# EAGLE design SkateRemote (EAGLE 8.2.0)
COMPANY: ADAFRUIT INDUSTRIES; DRAWN: KTOWN; REV: B
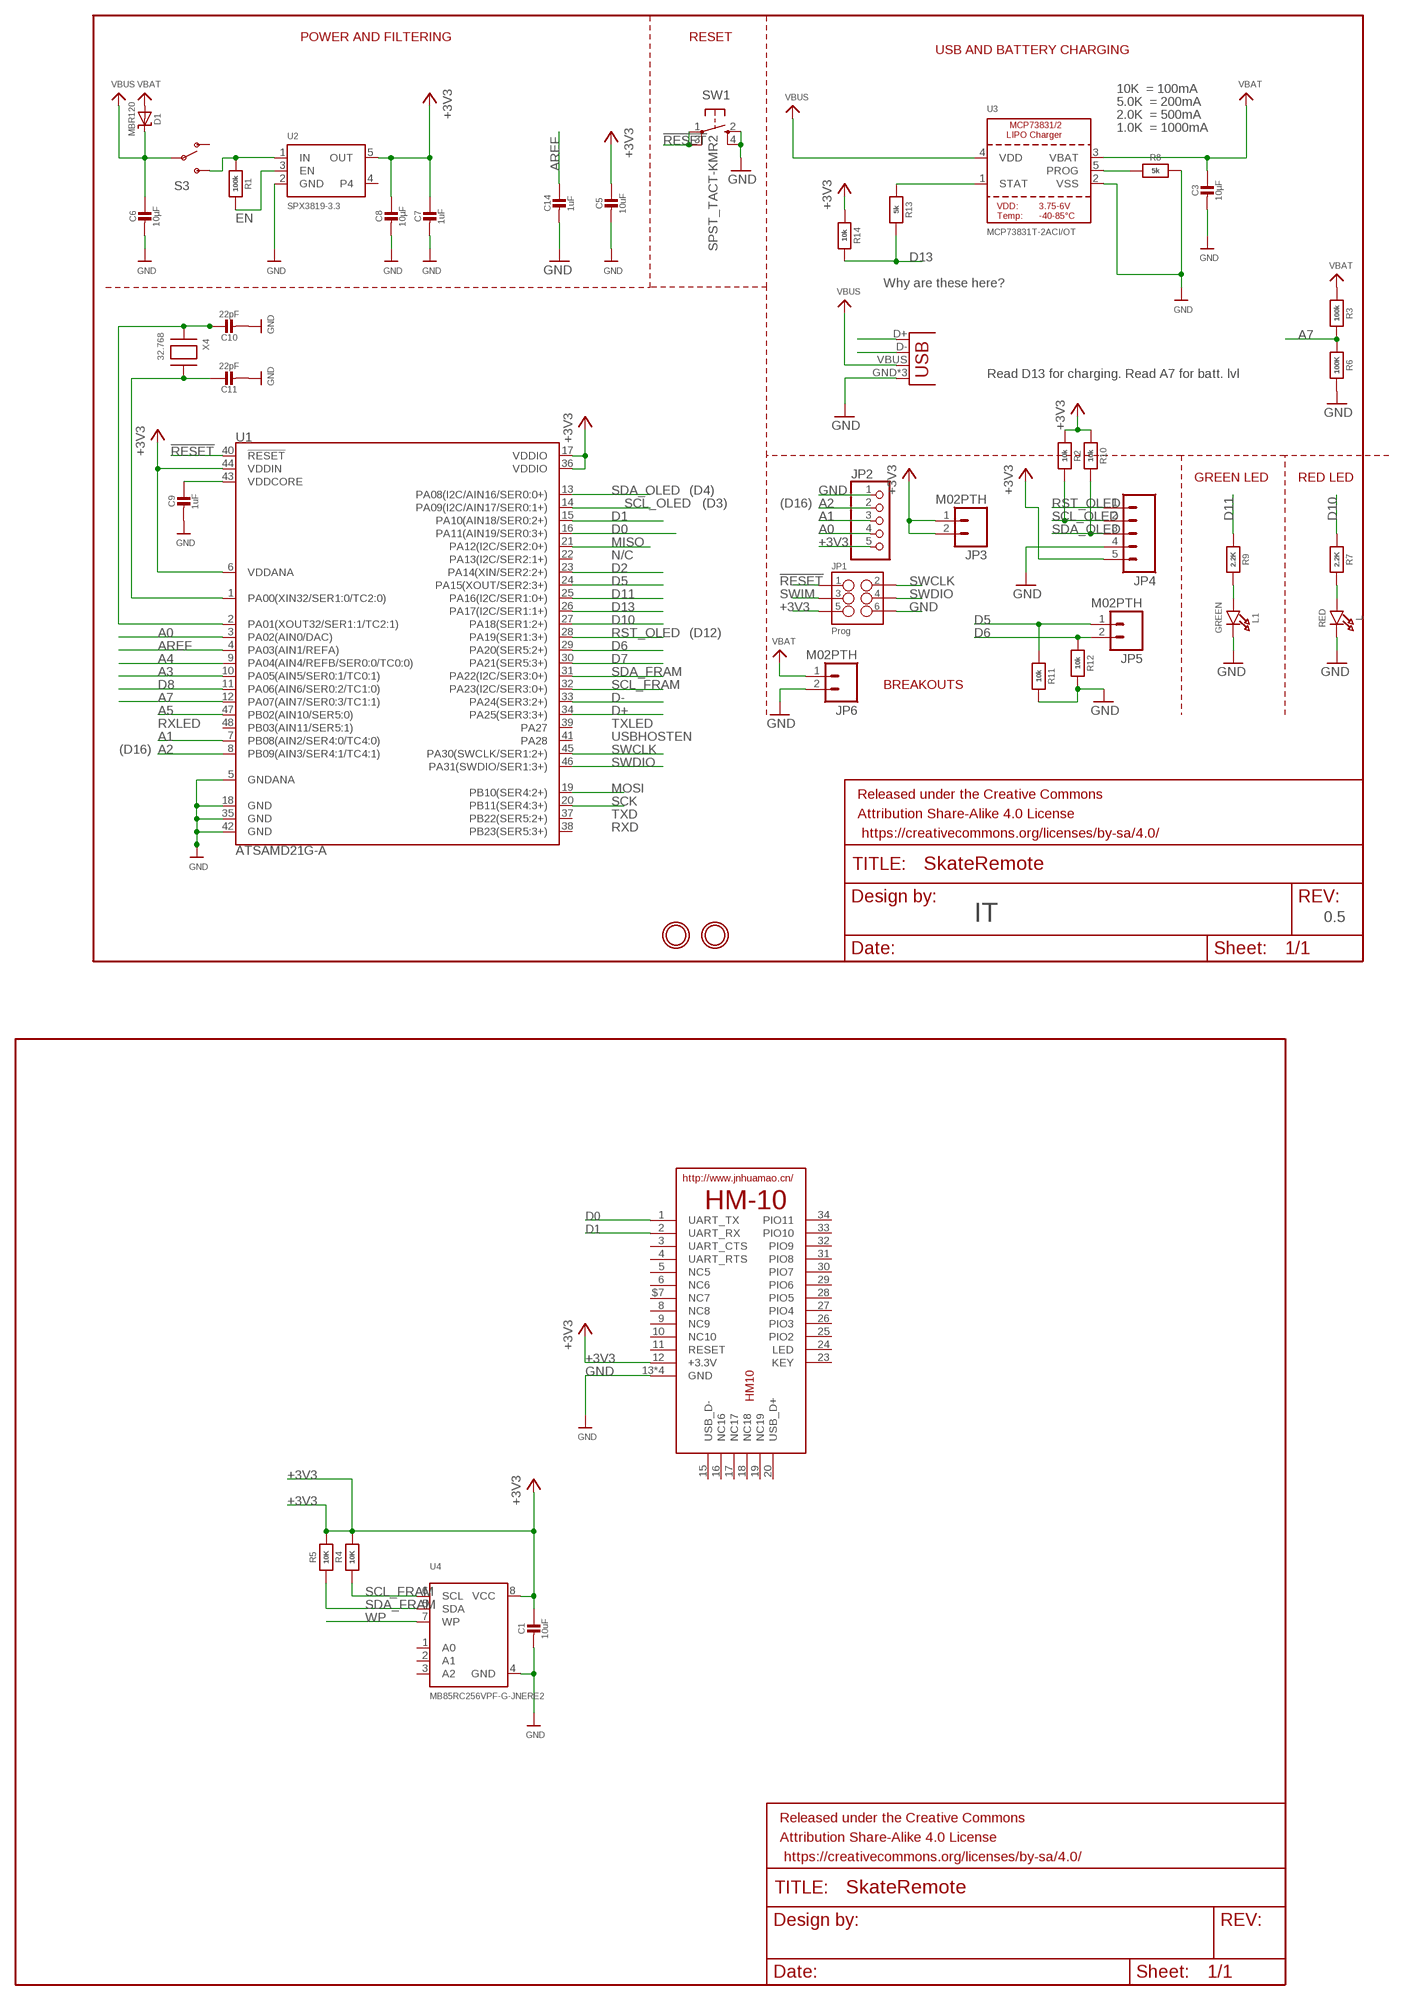
[diagram p0: schematic, sheet 1]

## Parts
C1  10uF  CAP_CERAMIC_0805MP  [_0805MP]
C3  10µF  CAP_CERAMIC0805-NOOUTLINE  [0805-NO]
C5  10uF  CAP_CERAMIC0805-NOOUTLINE  [0805-NO]
C6  10µF  CAP_CERAMIC0805-NOOUTLINE  [0805-NO]
C7  1uF  CAP_CERAMIC0805-NOOUTLINE  [0805-NO]
C8  10µF  CAP_CERAMIC0805-NOOUTLINE  [0805-NO]
C9  1uF  CAP_CERAMIC0805-NOOUTLINE  [0805-NO]
C10  22pF  CAP_CERAMIC0805-NOOUTLINE  [0805-NO]
C11  22pF  CAP_CERAMIC0805-NOOUTLINE  [0805-NO]
C14  1uF  CAP_CERAMIC0805-NOOUTLINE  [0805-NO]
D1  MBR120  DIODE-SCHOTTKYSOD-123  [SOD-123]
FRAME2  FRAME-LETTER  [CREATIVE_COMMONS]
FRAME3  FRAME-LETTER  [CREATIVE_COMMONS]
HM10  HM-10-BOARD  [26.9X13X2.2_BOARD]
JP1  Prog  M03X22X3_SILK_MALE_PTH  [2X3]
JP2  PINHD-1X5  [1X05]
JP3  M02PTH  [1X02]
JP4  M05PTH  [1X05]
JP5  M02PTH  [1X02]
JP6  M02PTH  [1X02]
L  RED  LED0805_NOOUTLINE  [CHIPLED_0805_NOOUTLINE]
L1  GREEN  LED0805_NOOUTLINE  [CHIPLED_0805_NOOUTLINE]
R1  100k  RESISTOR0805_NOOUTLINE  [0805-NO]
R2  10k  RESISTOR0805_NOOUTLINE  [0805-NO]
R3  100k  RESISTOR0805_NOOUTLINE  [0805-NO]
R4  10K  RESISTOR_0805MP  [_0805MP]
R5  10K  RESISTOR_0805MP  [_0805MP]
R6  100K  RESISTOR0805_NOOUTLINE  [0805-NO]
R7  2.2K  RESISTOR0805_NOOUTLINE  [0805-NO]
R8  5k  RESISTOR0805_NOOUTLINE  [0805-NO]
R9  2.2K  RESISTOR0805_NOOUTLINE  [0805-NO]
R10  10k  RESISTOR0805_NOOUTLINE  [0805-NO]
R11  10k  RESISTOR0805_NOOUTLINE  [0805-NO]
R12  10k  RESISTOR0805_NOOUTLINE  [0805-NO]
R13  5k  RESISTOR0805_NOOUTLINE  [0805-NO]
R14  10k  RESISTOR0805_NOOUTLINE  [0805-NO]
S3  SWITCH-SPDT-SMD-A  [SWITCH-SPST-SMD-A]
SW1  SPST_TACT-KMR2  [KMR2]
U1  ATSAMD21G-A  [TQFP-48]
U2  SPX3819-3.3  VREG_SOT23-5  [SOT23-5]
U3  MCP73831T-2ACI/OT  MCP73831/2  [SOT23-5]
U4  MB85RC256VPF-G-JNERE2  FRAM_SOIC8_I2C  [SOIC8_208MIL]
U$31  MOUNTINGHOLE2.5  [MOUNTINGHOLE_2.5_PLATED]
U$32  MOUNTINGHOLE2.5  [MOUNTINGHOLE_2.5_PLATED]
X3  microUSB  USB-MICROB  [USB-MICROB]
X4  32.768  XTAL-3.2X1.5  [XTAL3215]

## Nets
!RESET: JP1.1 SW1.1(P) SW1.3(P1) U1.40(!RESET!)
+3V3: C1.1 C5.1 C7.1 C8.1 HM10.12(+3.3V) JP1.5 JP2.5 JP3.1 JP3.2 JP4.5 R2.1 R4.2 R5.2 R10.1 R14.1 U1.6(VDDANA) U1.17(VDDIO) U1.36(VDDIO) U1.44(VDDIN) U2.5(OUT) U4.8(VCC)
A0: JP2.4 U1.3(PA02(AIN0/DAC))
A1: JP2.3 U1.7(PB08(AIN2/SER4:0/TC4:0))
A2: JP2.2 U1.8(PB09(AIN3/SER4:1/TC4:1))
A3: U1.10(PA05(AIN5/SER0:1/TC0:1))
A4: U1.9(PA04(AIN4/REFB/SER0:0/TC0:0))
A5: U1.47(PB02(AIN10/SER5:0))
A7: R3.2 R6.1 U1.12(PA07(AIN7/SER0:3/TC1:1))
AREF: C14.1 U1.4(PA03(AIN1/REFA))
D0: HM10.1(UART_TX) U1.16(PA11(AIN19/SER0:3+))
D1: HM10.2(UART_RX) U1.15(PA10(AIN18/SER0:2+))
D2: U1.23(PA14(XIN/SER2:2+))
D5: JP5.1 R11.1 U1.24(PA15(XOUT/SER2:3+))
D6: JP5.2 R12.1 U1.29(PA20(SER5:2+))
D7: U1.30(PA21(SER5:3+))
D8: U1.11(PA06(AIN6/SER0:2/TC1:0))
D10: R7.1 U1.27(PA18(SER1:2+))
D11: R9.1 U1.25(PA16(I2C/SER1:0+))
D13: R13.2 R14.2 U1.26(PA17(I2C/SER1:1+))
D+: U1.34(PA25(SER3:3+)) X3.D+
D-: U1.33(PA24(SER3:2+)) X3.D-
EN: R1.2 U2.3(EN)
GND: C1.2 C3.2 C5.2 C6.2 C7.2 C8.2 C9.2 C10.2 C11.2 C14.2 HM10.13(GND) HM10.14(GND) HM10.21(GND) HM10.22(GND) JP1.6 JP2.1 JP4.4 JP6.2 L1.C L.C R6.2 R8.2 R11.2 R12.2 SW1.2(S) SW1.4(S1) U1.5(GNDANA) U1.18(GND) U1.35(GND) U1.42(GND) U2.2(GND) U3.2(VSS) U4.4(GND) X3.GND X3.MT1(GND) X3.MT2(GND)
MISO: U1.21(PA12(I2C/SER2:0+))
MOSI: U1.19(PB10(SER4:2+))
N$1: R13.1 U3.1(STAT)
N$2: L.A R7.2
N$4: R8.1 U3.5(PROG)
N$5: R1.1 S3.3(S) U2.1(IN)
N$6: L1.A R9.2
N$23: C10.1 U1.2(PA01(XOUT32/SER1:1/TC2:1)) X4.P$1
N$29: C11.1 U1.1(PA00(XIN32/SER1:0/TC2:0)) X4.P$2
RST_OLED: JP4.1 U1.28(PA19(SER1:3+))
SCK: U1.20(PB11(SER4:3+))
SCL_FRAM: R4.1 U1.32(PA23(I2C/SER3:0+)) U4.6(SCL)
SCL_OLED: JP4.2 R2.2 U1.14(PA09(I2C/AIN17/SER0:1+))
SDA_FRAM: R5.1 U1.31(PA22(I2C/SER3:0+)) U4.5(SDA)
SDA_OLED: JP4.3 R10.2 U1.13(PA08(I2C/AIN16/SER0:0+))
SWCLK: JP1.2 U1.45(PA30(SWCLK/SER1:2+))
SWDIO: JP1.4 U1.46(PA31(SWDIO/SER1:3+))
SWIM: JP1.3
VBAT: C3.1 D1.A JP6.1 R3.1 U3.3(VBAT)
VBUS: C6.1 D1.C S3.2(P) U3.4(VDD) X3.VBUS
VDDCORE: C9.1 U1.43(VDDCORE)
WP: U4.7(WP)
Unconnected: HM10.3(UART_CTS) HM10.4(UART_RTS) HM10.5(NC5) HM10.6(NC6) HM10.8(NC8) HM10.9(NC9) HM10.10(NC10) HM10.11(RESET) HM10.15(USB_D-) HM10.16(NC16) HM10.17(NC17) HM10.18(NC18) HM10.19(NC19) HM10.20(USB_D+) HM10.23(KEY) HM10.24(LED) HM10.25(PIO2) HM10.26(PIO3) HM10.27(PIO4) HM10.28(PIO5) HM10.29(PIO6) HM10.30(PIO7) HM10.31(PIO8) HM10.32(PIO9) HM10.33(PIO10) HM10.34(PIO11) HM10.$7(NC7) S3.1(O) U1.22(PA13(I2C/SER2:1+)) U1.37(PB22(SER5:2+)) U1.38(PB23(SER5:3+)) U1.39(PA27) U1.41(PA28) U1.48(PB03(AIN11/SER5:1)) U2.4 U4.1(A0) U4.2(A1) U4.3(A2)

## Notes on the sheet
- POWER AND FILTERING | RESET
- USB AND BATTERY CHARGING
- 10K  = 100mA
- 5.0K  = 200mA
- 2.0K  = 500mA
- 1.0K  = 1000mA
- Why are these here?
- Read D13 for charging. Read A7 for batt. lvl
- GREEN LED | RED LED
- (D4)
- (D3) | (D16)
- N/C
- (D12)
- BREAKOUTS
- RXLED | TXLED
- USBHOSTEN
- (D16)
- TXD
- RXD
- IT | 0.5

## Library data of the parts
C1 C3 C5-C11 C14 = microbuilder:CAP_CERAMIC: Ceramic Capacitors For new designs, use the packages preceded by an '_' character since they are more reliable: The following footprints should be used on most boards: _0402 - Standard footprint for regular board layouts _0603 - Standard footprint for regular board layouts _0805 - Standard footprint for regular board layouts _1206 - Standard footprint for regular board layouts For extremely tight-pitch boards where space is at a premium, the following 'micro-pitch' footprints can be used (smaller pads, no silkscreen outline, etc.): _0402MP - Micro-pitch footprint for very dense/compact boards _0603MP - Micro-pitch footprint for very dense/compact boards _0805MP - Micro-pitch footprint for very dense/compact boards _1206MP - Micro-pitch footprint for very dense/compact boards
D1 = microbuilder:DIODE-SCHOTTKY
FRAME2 FRAME3 = SparkFun-Aesthetics:FRAME-LETTER: Schematic Frame Standard 8.5x11 US Letter frame
HM10 = JNHuaMao-NoLabels:HM-10: HM Bluetooth module use TI CC2540 or CC2541, Master and slave roles in one, transmission version and remote control version and PIO state acquisition functions in one, Support the AT command modify module parameters, Convenient and flexible.
JP1 = SparkFun-Connectors:M03X2: 2x3 .1" header. Shrouded, with keying- CONN-10681 SMT- CONN-11415 Pogo pins- HW-11044; PROD_ID: CONN-09701
JP2 = pinhead:PINHD-1X5: PIN HEADER
JP3 JP5 JP6 = SparkFun-Connectors:M02: Standard 2-pin 0.1" header. Use with - straight break away headers ( PRT-00116) - right angle break away headers (PRT-00553) - swiss pins (PRT-00743) - machine pins (PRT-00117) - female headers (PRT-00115) Molex polarized connector foot print use with: PRT-08233 with associated crimp pins and housings. 2.54_SCREWTERM for use with PRT-10571. 3.5mm Screw Terminal footprints for PRT-08084 5mm Screw Terminal footprints for use with PRT-08432
JP4 = SparkFun-Connectors:M05: Header 5 Standard 5-pin 0.1" header. Use with straight break away headers (SKU : PRT-00116), right angle break away headers (PRT-00553), swiss pins (PRT-00743), machine pins (PRT-00117), and female headers (PRT-00115). Molex polarized connector foot print use with SKU : PRT-08230 with associated crimp pins and housings.
L L1 = microbuilder:LED: LED 0603 - 0603 Surface Mount Package 2mA: Green LED - Low Power (3.9mcd, 2ma, 1.7Vf) - Digikey: 475-2709-2-ND Orange LED - Low Power (9.8mcd, 2ma, 1.8Vf) - Digikey: 475-1194-2-ND Red LED - Low Power (5mcd, 2ma, 1.8Vf) - Digikey: 475-1195-2-ND Yellow LED - Low Power (7mcd, 2ma, 1.8Vf) - Digikey: 475-1196-2-ND 5mA: Blue LED - Low Power (17mcd, 5ma, 2.9Vf) - Digikey: LNJ937W8CRACT-ND 0805 - 0805 Surface Mount Package 2mA: Red LED (8.8mcd, 2mA, 1.8Vf, Clear) - Low Power [Digikey: 475-2510-1-ND] Green LED (5mcd, 2mA, 1.8Vf, Clear) - Low Power [Digikey: 475-2730-1-ND] Yellow LED (11.3mcd, 2mA, 1.8Vf, Clear) - Low Power [Digikey: 475-2555-1-ND] 20mA: Red LED (104mcd, 20mA, Diffused) - LS R976 [Digikey: 475-1278-6-ND] Red LED (12mcd, 20mA, 2.0Vf, Clear) - APT2012EC [Digikey: 754-1128-1-ND] Green LED (15mcd, 20mA, 2.2Vf, Clear) - APT2012GC [Digikey: 754-1131-1-ND] Orange LED (160mcd, 20mA, 2.1Vf, Clear) - APT2012SECK [Digikey: 754-1130-1-ND] 1206 - 1206 Surface Mount Package Green LED (26mcd, 20mA, Diffused) - LG N971 [Digikey: 475-1407-6-ND] Red LED (15mcd, 20mA, Diffused) - LH N974 [Digikey: 475-1416-6-ND] Cree - Cree High-Power Surface Mount LEDs XPEBWT-L1-0000-00D50 - White 111lm 350mA 2.9Vf 6200K 110° XTEAWT-00-0000-00000LEE3 - White 114lm 350mA 2.85Vf 5000K 115° Everlight - Everlight 45-21 Series Surface Mount LEDs 45-21/QK2C-B2832AC2CB2/2T - Warm White 2000mcd 20mA 3.25Vf 3050K 120° 45-21/LK2C-B38452C4CB2/2T - Nuetral White 2000mcd 20mA 3.25Vf 4150K 120° 45-21/LK2C-B50634C6CB2/2T - Cold White 2200mcd 20mA 3.25Vf 5650K 120° PLCC2 Reverse Mount LS T77K-J1L2-1-0-2-R18-Z - Red 11.25mcd 2mA 1.8Vf 630nm 120° LO T77K-L1M2-24-Z - Orange 19.6mcd 2mA 1.8Vf 606nm 120° LY T77K-K2M1-26-Z - Yellow 15.7mcd 2mA 1.8Vf 587nm 120°
R1-R14 = microbuilder:RESISTOR: Resistors For new designs, use the packages preceded by an '_' character since they are more reliable: The following footprints should be used on most boards: _0402 - Standard footprint for regular board layouts _0603 - Standard footprint for regular board layouts _0805 - Standard footprint for regular board layouts _1206 - Standard footprint for regular board layouts For extremely tight-pitch boards where space is at a premium, the following 'micro-pitch' footprints can be used (smaller pads, no silkscreen outline, etc.): _0402MP - Micro-pitch footprint for very dense/compact boards _0603MP - Micro-pitch footprint for very dense/compact boards _0805MP - Micro-pitch footprint for very dense/compact boards _1206MP - Micro-pitch footprint for very dense/compact boards
S3 = SparkFun-Electromechanical:SWITCH-SPDT: SPDT Switch Simple slide switch, Spark Fun Electronics SKU : COM-00102 DPDT SMT slide switch, AYZ0202, SWCH-08179
SW1 = adafruit:SPST_TACT: SMT 6mm switch, EVQQ2 series http://www.ladyada.net/library/eagle
U1 = samd21-temp:ATSAMD21G: Atmel SAMD21G SMART ARM-Based Microcontroller The Atmel ® | SMART  SAM D21 is a series of low-power microcontrollers using the 32-bit ARM ® Cortex ® -M0+ processor, and ranging from 32- to 64-pins with up to 256KB Flash and 32KB of SRAM. The SAM D21 devices operate at a maximum frequency of 48MHz and reach 2.46 CoreMark/MHz. They are designed for simple and intuitive migration with identical peripheral modules, hex compatible code, identical linear address map and pin compatible migration paths between all devices in the product series. All devices include intelligent and flexible peripherals, Atmel Event System for inter-peripheral signaling, and support for capacitive touch button, slider and wheel user interfaces.; PROD_ID: IC-13064
U2 = microbuilder:VREG_SOT23-5: SOT23-5 Fixed Voltage Regulators Part Current Out V Out V In V Dropout θJA (°C/W) TJ (°C) Digikey Part No. ADP121 150mA 3.3V 3.4-5.5V 0.09V @ 150mA -- -- ADP121-AUJZ33R7CT-ND ADP121 150mA 3.0V 3.1-5.5V 0.09V @ 150mA -- -- ADP121-AUJZ30R7CT-ND ADP122 300mA 3.3V 3.4-5.5V 0.085V @ 300mA -- -- ADP122AUJZ-3.3-R7CT-ND ADP1712 300mA 3.3V 3.5-5.5V 0.17V @ 300mA -- -- ADP1712AUJZ-3.3-R7TR-ND AP7311 (Low Cost) 150mA 3.3V 3.5-6V 0.15V @ 150mA -- -- AP7311-33WG-7DICT-ND LD39015M18R 150mA 1.8V 1.9V-5.5V 0.08V @ 100mA -- -- 497-6977-1-ND LP2985A-33DBVR 150mA 3.3V 3.3-16V 0.28V @ 150mA 206 150 296-18479-1-ND MCP1824T-3302E/OT 300mA 3.3V 3.5V-6V 0.2V @ 300mA -- -- MCP1824T-3302E/OTCT-ND MIC5205-2.5YM5 TR 150mA 2.5V 2.7-16V 0.165V @ 150mA -- -- 576-1257-2-ND MIC5205-3.0YM5 TR 150mA 3.0V 3.2V-16V 0.165V @ 150mA -- -- 576-1258-2-ND MIC5205-3.3YM5 TR 150mA 3.3V 3.5V-16V 0.165V @ 150mA -- -- 576-1259-2-ND TPS780330220 150mA 3.3V+2.2V 3.6-5.5V 250mV Max -- -- 296-23332-1-ND TDA3663/N1,135 100mA 3.3V 3.5-45V 0.18V @ 50mA -- -- 568-5343-1-ND Max operating temp can be calculated using θJA, TJ (max junction temperature), and power in watts. Set the "Maximum Ambient Temperature" until it reaches TJ ("Max Junction Temperature"), which is the absolute limit for safe use of the regulator: Heat Sink Temperature Calculator <http://www.daycounter.com/Calculators/Heat-Sink-Temperature-Calculator.phtml> For example, With 12V source into a 3.3V LP2985 and a 30mA load, we are dissipating (12V-3.3V) * 0.03A = 0.261W. With a θJA of 206 °C/W, a TJ of 150°C, and 261mW we can safely use the chip without a heat sink up to 75°C (=147.1°C Junction Temperature).
U3 = microbuilder:MCP73831/2: MCP73831/2 LIPO Charger VDD: 3.75 - 6V Temp -40 - 85°C Programmable Charge Rate: 15-500mA NOTE: STAT is a tri-state logic output on the MCP73831 and an open-drain output on the MCP73832. SOT23-5 with 4.2V output and tri-state logic on STAT = MCP73831T-2ACI/OT
U4 = microbuilder:FRAM_SOIC8_I2C: I2C FRAM - SOIC8 Package 256KBit (32Kx8) - MB85RC256VPF-G-JNERE2 - SOIC-8 200 Mil, 2.7-5.5V, -40�C-85�C
U$31 U$32 = microbuilder:MOUNTINGHOLE: Mounting Hole For #2 screws (0.086"/2.18mm width, 0.094"/2.4mm hole) use 2.5mm; BOM: EXCLUDE
X3 = SparkFun-Connectors:USB: USB Connectors USB-B-PTH is fully proven SKU : PRT-00139/CONN-08278 USB-miniB is fully proven SKU : PRT-00587 USB-A-PCB is untested. USB-A-H is throughly reviewed, but untested. Spark Fun Electronics SKU : PRT-00437 USB-B-SMT is throughly reviewed, but untested. Needs silkscreen touching up. USB-A-S has not been used/tested USB-MB-H has not been used/tested USB-MICROB has been used. CONN-09505; PROD_ID: CONN-09505
X4 = adafruit2:XTAL: Low cost SMT crystals, no capacitors included http://www.ladyada.net/library/eagle

## Board
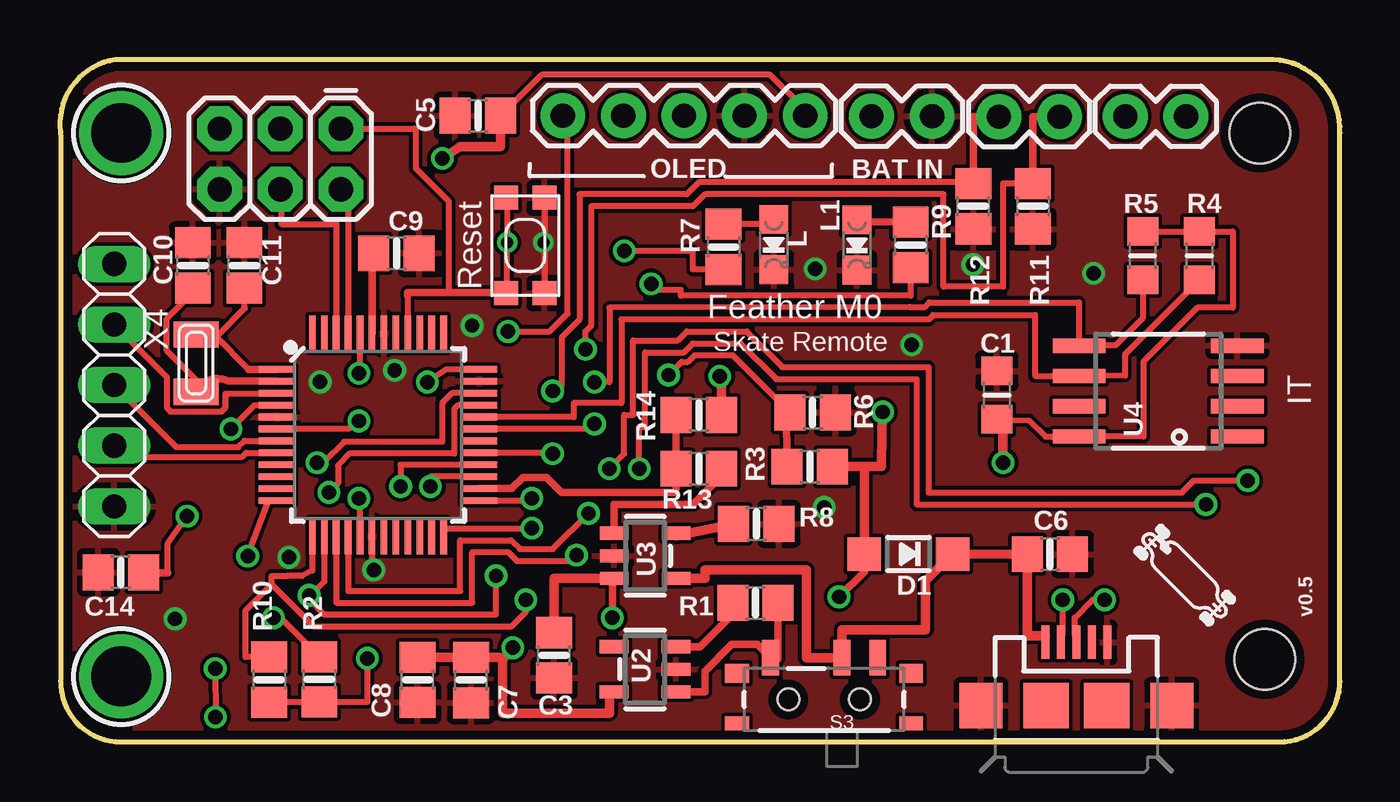
[diagram p1: board, top side]
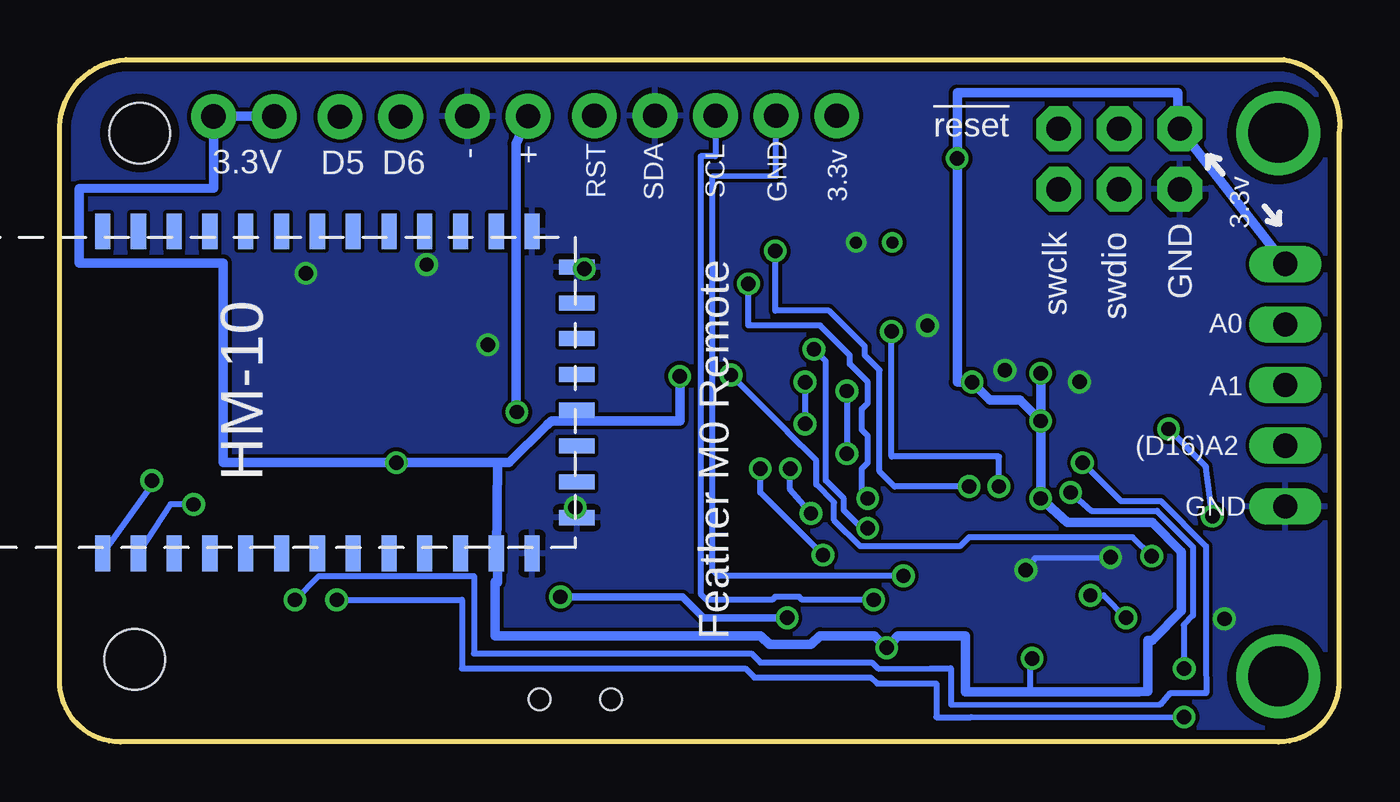
[diagram p2: board, bottom side, seen from below]

Size 53.64 x 28.6 mm. Coordinates in mm from the lower left corner, seen from the top.
Outline: 0.02,25.53 arc-90 2.34,28.6 50.87,28.6 arc-90 53.63,25.53 53.63,2.54 arc-90 51.09,0 2.56,0 arc-90 0.02,2.54
Outline: 0.02,25.46 0.02,2.58
Copper layers (1*16): Top 0.0356mm / dielectric 1.5011mm / Bottom 0.0356mm
Design rules "oshpark-2layer": minimum track width 6mil, minimum drill 13mil, track to track 6mil, track to pad 6mil, pad to pad 6mil, via to via 6mil, smd to smd 6mil, copper to edge 15mil, drill to drill 6mil, minimum pad ring 7mil, minimum via ring 7mil, stop-mask expansion 2.5mil, vias tented up to drill 0mil, thermal gap 10mil
Holes 2.54 mm at 50.28,25.53 50.48,3.47

### Footprints (pad centres in the part's own frame; a part is rotated, then mirrored left to right if it is on the bottom)
_0805MP = smd 1.2 x 1.3: 1 -1.016,0; 2 1.016,0
0805-NO = smd 1.3 x 1.5: 1 -0.95,0; 2 0.95,0
SOD-123 = smd 1.4 x 1.4: A 1.85,0; C -1.85,0
26.9X13X2.2_BOARD = smd 1.5 x 0.635: 1 -7.5,0; 2 -7.5,-1.5; 3 -7.5,-3; 4 -7.5,-4.5; 5 -7.5,-6; 6 -7.5,-7.5; 8 -7.5,-10.5; 9 -7.5,-12; 10 -7.5,-13.5; 11 -7.5,-15; 12 -7.5,-16.5; 13 -7.5,-18; 22 6,-18; 23 6,-16.5; 24 6,-15; 25 6,-13.5; 26 6,-12; 27 6,-10.5; 28 6,-9; 29 6,-7.5; 30 6,-6; 31 6,-4.5; 32 6,-3; 33 6,-1.5; 34 6,0; $7 -7.5,-9 | smd 0.635 x 1.5: 14 -6,-19.875; 15 -4.5,-19.875; 16 -3,-19.875; 17 -1.5,-19.875; 18 0,-19.875; 19 1.5,-19.875; 20 3,-19.875; 21 4.5,-19.875
2X3 = drill 1.016 pad 1.88 octagon: 1 0,0; 2 0,2.54; 3 2.54,0; 4 2.54,2.54; 5 5.08,0; 6 5.08,2.54
1X05 = drill 1.016 long: 1 -5.08,0; 2 -2.54,0; 3 0,0; 4 2.54,0; 5 5.08,0
1X02 = drill 1.016 pad 1.88: 1 0,0; 2 2.54,0
1X05' = drill 1.016 pad 1.88: 1 0,0; 2 2.54,0; 3 5.08,0; 4 7.62,0; 5 10.16,0
CHIPLED_0805_NOOUTLINE = smd 1.2 x 1.2: A 0,-1.05; C 0,1.05
SWITCH-SPST-SMD-A = smd 0.7 x 1.5: 1 -2.25,-1.75; 2 -0.75,-1.75; 3 2.25,-1.75 | smd 1 x 0.6: GND1 -3.65,1; GND3 3.65,1 | smd 1 x 0.8: GND2 -3.65,-1.1; GND4 3.65,-1.1 | hole 0.9: -1.5,0; 1.5,0
KMR2 = smd 1 x 1: 1 2,0.8; 2 2,-0.8; 3 -2,0.8; 4 -2,-0.8
TQFP-48 = smd 1.5 x 0.28: 1 -4.25,2.75; 2 -4.25,2.25; 3 -4.25,1.75; 4 -4.25,1.25; 5 -4.25,0.75; 6 -4.25,0.25; 7 -4.25,-0.25; 8 -4.25,-0.75; 9 -4.25,-1.25; 10 -4.25,-1.75; 11 -4.25,-2.25; 12 -4.25,-2.75; 25 4.25,-2.75; 26 4.25,-2.25; 27 4.25,-1.75; 28 4.25,-1.25; 29 4.25,-0.75; 30 4.25,-0.25; 31 4.25,0.25; 32 4.25,0.75; 33 4.25,1.25; 34 4.25,1.75; 35 4.25,2.25; 36 4.25,2.75 | smd 0.28 x 1.5: 13 -2.75,-4.25; 14 -2.25,-4.25; 15 -1.75,-4.25; 16 -1.25,-4.25; 17 -0.75,-4.25; 18 -0.25,-4.25; 19 0.25,-4.25; 20 0.75,-4.25; 21 1.25,-4.25; 22 1.75,-4.25; 23 2.25,-4.25; 24 2.75,-4.25; 37 2.75,4.25; 38 2.25,4.25; 39 1.75,4.25; 40 1.25,4.25; 41 0.75,4.25; 42 0.25,4.25; 43 -0.25,4.25; 44 -0.75,4.25; 45 -1.25,4.25; 46 -1.75,4.25; 47 -2.25,4.25; 48 -2.75,4.25
SOT23-5 = smd 0.55 x 1.2: 1 -0.95,-1.3; 2 0,-1.3; 3 0.95,-1.3; 4 0.95,1.3; 5 -0.95,1.3
SOIC8_208MIL = smd 0.6 x 2.2: 1 -1.905,-3.315; 2 -0.635,-3.315; 3 0.635,-3.315; 4 1.905,-3.315; 5 1.905,3.315; 6 0.635,3.315; 7 -0.635,3.315; 8 -1.905,3.315
MOUNTINGHOLE_2.5_PLATED = drill 2.5 pad 3.2: P$1 0,0
USB-MICROB = smd 0.35 x 1.4: D+ 0,2.65; D- -0.65,2.65; GND 1.3,2.65; ID 0.65,2.65; VBUS -1.3,2.65 | smd 1.8 x 1.9: MT1 -4,0; MT2 4,0 | smd 1.9 x 1.9: P$1 -1.27,0; P$2 1.27,0
XTAL3215 = smd 1.1 x 1.9: P$1 1.2,0; P$2 -1.2,0

### Placement (x,y rotation side)
C1  39.26,14.54 90 top
C3  20.7,3.63 270 top
C5  17.52,26.25 180 top
C6  41.48,7.87 0 top
C7  17.22,2.59 270 top
C8  14.99,2.6 270 top
C9  14.1,20.48 0 top
C10  5.57,19.97 90 top
C11  7.73,19.97 90 top
C14  2.56,7.11 180 top
D1  35.55,7.88 180 top
FRAME2  5.9,-22.29 0 top  (outside the outline)
FRAME3  5.9,-30.76 0 top  (outside the outline)
HM10  51.84,15.4 90 bottom
JP1  11.77,25.71 180 top
JP2  2.27,14.96 90 top
JP3  44.65,26.22 0 top
JP4  [1X05']  21.07,26.25 0 top
JP5  41.89,26.21 180 top
JP6  34.01,26.23 0 top
L  29.92,20.85 180 top
L1  33.4,20.83 180 top
R1  29.15,5.83 180 top
R2  10.88,2.62 90 top
R3  31.43,11.54 180 top
R4  47.75,20.38 90 top
R5  45.37,20.38 90 top
R6  31.55,13.81 0 top
R7  27.81,20.75 90 top
R8  29.18,9.14 0 top
R9  35.65,20.83 90 top
R10  8.77,2.61 90 top
R11  40.77,22.46 270 top
R12  38.27,22.46 270 top
R13  26.77,11.46 180 top
R14  26.77,13.71 180 top
S3  32.02,1.78 180 top
SW1  19.5,20.81 90 top
U1  13.33,12.87 0 top
U2  24.52,3.05 90 top
U3  24.53,7.8 270 top
U4  46.02,14.71 90 top
U$31  2.56,25.53 270 top
U$32  2.56,2.75 270 top
X3  42.59,1.53 0 top
X4  5.71,15.87 270 top

### Tracks (layer width: path | path; a pad name or v marks a point on that pad's centre or on a via)
!RESET  (via drill 0.5)
  Top 0.254: SW1.1 18.74,22.77 v18.74,20.94 18.74,18.85 SW1.3 | JP1.1 14.84,25.71 14.91,25.71 14.91,24.04 16.28,22.68 16.28,18.85 | 14.58,18.71 U1.40
  Top 0.305: 18.74,18.85 16.28,18.85 14.58,18.85 14.58,18.71
+3V3  (via drill 0.6)
  Top 0.254: U1.17 12.58,10.15 v12.52,10.21 | v12.52,15.46 12.58,15.9 U1.44 | v12.52,13.46 12.11,13.12 U1.6 | U1.36 16.19,15.62 v15.4,15.08 | C1.1 40.61,13.47 41.3,12.8 U4.8 45.41,12.8 45.41,15.94 47.67,18.21 49.15,18.21 49.15,21.4 R4.2 R5.2 | JP4.5 31.23,26.49 29.76,27.97 20.19,27.97 C5.1 | R10.1 10.88,1.66 R2.1 12.89,1.67 v12.89,3.5
  Top 0.406: U2.5 23.02,2.1 23.02,1.21 18.55,1.21 18.55,3.46 | 18.55,3.46 v18.98,3.95 | 18.45,26.25 C5.1 18.47,24.96 16.77,24.96 v16.02,24.46 | v39.52,11.71 39.52,13.46 C1.1 | R14.1 27.72,15.33 v27.65,15.33 | 18.55,3.46 18.41,3.54 C7.1 15.61,3.55 C8.1
  Bottom 0.254: v12.89,3.5 12.98,3.5 12.98,2.11
  Bottom 0.406: v12.52,13.46 v12.52,10.21 11.4,9.21 11.38,9.19 7.84,9.19 6.62,7.97 6.62,5.5 7.85,4.27 8.03,4.27 8.03,3.92 8.03,2.11 8.4,2.11 12.98,2.11 15.68,2.11 15.68,4.45 18.5,4.45 v18.98,3.95 19.49,4.46 21.77,4.46 22.15,4.08 23.9,4.08 24.27,4.46 35.4,4.46 35.4,6.71 35.29,6.69 35.29,8.07 HM10.12 35.28,11.71 | v12.52,13.46 v12.52,15.46 | 35.28,11.71 v39.52,11.71 46.77,11.71 46.77,20.08 52.82,20.07 52.82,23.19 47.17,23.21 JP3.2 JP3.1 | JP2.5 JP1.5 6.77,25.71 6.77,27.21 16.02,27.21 v16.02,24.46 16.02,15.08 v15.4,15.08 14.65,14.33 13.4,14.33 v12.52,13.46 | v27.65,15.33 27.65,13.46 33.02,13.46 33.2,13.28 34.79,11.71 35.28,11.71
A0
  Top 0.254: 9.57,14.62 U1.3 9.06,14.6 6.94,14.6 6.94,14.01 6.77,13.84 4.64,13.84 4.48,14.01 4.48,15.29 JP2.4
A1
  Top 0.254: U1.7 7.74,12.62 7.48,12.36 4.87,12.36 JP2.3
A2
  Top 0.254: U1.8 7.81,12.12 7.65,11.95 2.74,11.95 JP2.2
A7  (via drill 0.6)
  Top 0.254: U1.12 8.74,10.12 v7.87,7.79 | v25.51,15.38 26.05,15.93 26.32,15.93 26.61,16.22 28.19,16.22 R6.1
  Top 0.305: R3.2 30.45,14.01 R6.1
  Bottom 0.254: v7.87,7.79 8.67,8.58 15.53,8.58 15.91,8.2 20.09,8.2 21.18,9.29 21.18,10.04 21.93,10.79 21.93,11.79 23.16,13.02 23.16,13.03 v25.51,15.38
AREF  (via drill 0.6)
  Top 0.254: 4.52,7.08 4.52,8.33 v5.33,9.47 | v7.16,13.12 8.17,14.12 U1.4
  Top 0.305: 4.52,7.08 3.51,7.08 C14.1
  Bottom 0.254: v5.33,9.47 5.59,11.55 v7.16,13.12
D0  (via drill 0.6)
  Top 0.254: U1.16 12.08,6.33 16.77,6.33 16.77,8.46 18.9,8.46 19.27,8.08 20.65,8.08 v22.15,9.58 | v23.02,11.46 23.65,12.08 23.65,13.71 24.02,13.71 24.02,16.83 25.9,16.83 26.27,17.21 28.77,17.21 30.27,15.71 36.4,15.71 36.4,10.46 47.02,10.46 47.52,10.96 v49.77,10.96
  Bottom 0.254: v22.15,9.58 23.02,10.58 v23.02,11.46 | v49.77,10.96 49.7,10.89 HM10.1
D1  (via drill 0.6)
  Top 0.254: U1.15 11.58,5.83 17.27,5.83 17.27,7.96 18.77,7.96 19.15,7.58 21.4,7.58 v21.65,7.83 | v24.27,11.46 24.27,13.21 24.52,13.21 24.52,16.33 26.15,16.33 26.52,16.71 28.52,16.71 30.02,15.21 35.9,15.21 35.9,9.96 v48.02,9.96
  Bottom 0.254: v21.65,7.83 24.27,10.46 v24.27,11.46 | v48.02,9.96 49,9.96 HM10.2
D5  (via drill 0.6)
  Top 0.254: R11.1 39.52,23.41 39.52,19.08 37.02,19.08 37.02,22.96 27.02,22.96 26.52,22.46 22.27,22.46 22.27,17.46 22.02,17.21 v22.02,16.46 | U1.24 16.08,8.96 v19.77,8.96
  Top 0.305: JP5.1 40.77,26.21 R11.1
  Bottom 0.254: v19.77,8.96 20.02,8.96 20.77,9.71 20.77,10.21 21.52,10.96 21.52,15.96 v22.02,16.46
D6  (via drill 0.6)
  Top 0.254: R12.1 37.97,23.46 26.77,23.46 26.27,22.96 21.77,22.96 21.77,17.71 21.02,16.96 21.02,14.96 v20.65,14.71 | v20.65,12.08 20.52,12.12 U1.29
  Top 0.305: JP5.2 38.27,26.21 R12.1
  Bottom 0.254: v20.65,14.71 v20.65,12.08
D10  (via drill 0.6)
  Top 0.254: R7.1 26.52,19.8 26.52,20.58 v23.65,20.58 | U1.27 15.52,11.12 v15.52,10.71
  Bottom 0.254: v15.52,10.71 18.65,10.71 19.27,11.33 19.27,15.58 19.9,16.21 19.9,16.58 21.4,18.08 23.65,18.08 v23.65,20.58
D11  (via drill 0.6)
  Top 0.254: R9.1 35.65,18.71 26.02,18.71 26.02,18.96 24.77,18.96 v24.77,19.21 | U1.25 19.69,10.12 v19.77,10.21
  Bottom 0.254: v19.77,10.21 20.02,10.21 20.02,11.46 19.77,11.71 19.77,12.83 20.02,13.08 20.02,13.96 19.77,14.21 19.77,15.08 20.52,15.83 20.52,16.21 21.77,17.46 24.77,17.46 v24.77,19.21
D13
  Top 0.305: U1.26 18.94,10.62 19.4,11.08 20.4,11.08 21.02,10.46 25.77,10.46 25.82,10.62 R13.2 R14.2
D+  (via drill 0.6)
  Top 0.254: X3.D+ 42.56,4.46 42.52,4.46 42.52,5.21 43.27,5.96 v43.77,5.96 | U1.34 16.44,14.62 16.02,14.21 16.02,12.58 11.9,12.58 11.02,11.71 v10.77,11.71
  Bottom 0.254: v43.77,5.96 42.77,6.96 36.27,6.96 36.27,3.71 24.65,3.71 24.27,3.33 19.6,3.33 19.31,3.07 17.15,3.08 16.29,3.09 16.29,1.56 7.52,1.59 7.5,1.58 7.09,2.05 5.58,2.05 5.59,3.45 5.59,8.2 7.49,10.1 9.16,10.1 v10.77,11.71
D-  (via drill 0.6)
  Top 0.254: X3.D- 42.02,4.51 v42.02,5.96 | U1.33 16.69,14.12 16.52,13.96 16.52,12.08 12.15,12.08 11.65,11.58 11.65,10.83 v11.27,10.46 | v6.51,3.07 v6.52,1.05
  Bottom 0.254: v42.02,5.96 36.77,5.96 36.77,3.08 24.9,3.08 24.52,2.71 19.65,2.71 19.38,2.46 16.9,2.46 16.9,1.04 15.45,1.04 v6.52,1.05 | v6.51,3.07 6.53,3.07 6.53,4.91 6.14,5.3 6.14,8.17 7.66,9.69 10.41,9.69 v11.27,10.46
EN
  Top 0.305: R1.2 28.2,5.38 26.81,4 U2.3
GND  (via drill 0.5, 0.6)
  Top 0.254: SW1.2 SW1.4 20.3,18.69 | U1.18 13.08,7.15 13.15,7.08
  Bottom 0.254: v13.15,7.21 12.76,7.71 v9.59,7.74
  other vias: 20.26,20.94 4.82,5.16 14.02,15.58 10.9,15.09 17.27,17.46 35.69,16.65 32.02,9.83 31.65,19.83 38.26,20.01 43.32,19.64
  pour Top (isolate 0.12): 0.06,28.71 0.02,-0.17 53.5,-0.17 53.54,28.71
  pour Bottom (isolate 0.12): 53.5,-0.17 0.02,-0.17 0.02,28.68 53.5,28.68
N$1
  Top 0.305: R13.1 27.72,11.16 26.52,9.96 23.23,9.96 U3.1
N$2
  Top 0.254: L.A 29.99,21.71 R7.2
N$4
  Top 0.406: U3.5 25.83,8.64 R8.1
N$5
  Top 0.305: U2.1 27.02,2.1 27.02,2.96 28.15,4.08 29.22,4.08 S3.3 30.1,3.48 R1.1
N$6
  Top 0.305: L1.A 33.35,21.81 R9.2
N$23
  Top 0.254: X4.P$1 5.71,15.18 4.48,16.41 4.48,17.74 5.57,18.84 C10.1
  Top 0.305: U1.2 7.07,15.12 arc90 X4.P$1 | C10.1 5.02,18.48
N$29
  Top 0.254: 7.91,15.62 6.45,17.07 X4.P$2 6.64,17.07 7.75,18.18 7.75,19 C11.1
  Top 0.305: U1.1 7.91,15.62
RST_OLED  (via drill 0.6)
  Top 0.254: U1.28 14.27,11.62 v14.27,10.71 | v18.77,17.21 20.52,17.21 21.27,17.96 21.27,26.05 JP4.1
  Bottom 0.254: v14.27,10.71 14.27,11.96 18.77,11.96 v18.77,17.21
SCL_FRAM
  Top 0.254: U1.32 21.52,13.62 21.52,14.21 23.52,14.21 23.52,17.71 36.41,17.71 36.6,17.9 40.86,17.9 40.86,15.34 U4.6 | 42.7,15.33 U4.6 | R4.1 44.63,16.24 44.63,15.35 U4.6
SCL_OLED  (via drill 0.6)
  Top 0.254: v18.27,6.96 18.27,5.33 11.08,5.33 10.5,5.91 10.5,6.14 | U1.14 11.08,6.72 10.5,6.14 | 10.5,6.14 v10.44,6.14 | v8.95,5.21 9.24,5.21 R2.2
  Bottom 0.254: v18.27,6.96 26.02,6.96 26.27,7.21 26.27,23.71 23.6,23.73 23.61,23.73 JP4.2 | v10.44,6.14 9.88,6.14 v8.95,5.21
SDA_FRAM  (via drill 0.6)
  Top 0.254: v22.4,15.08 23.02,15.08 23.02,18.21 35.6,18.24 36.24,18.24 36.43,18.42 42.71,18.42 U4.5 42.72,16.62 44.23,16.62 45.37,17.77 R5.1 | v22.4,13.33 22.27,13.12 U1.31
  Bottom 0.254: v22.4,15.08 v22.4,13.33
SDA_OLED  (via drill 0.6)
  Top 0.254: v19.52,5.96 19.52,5.46 18.9,4.83 10.65,4.83 8.87,6.61 | U1.13 10.58,7.19 10.14,6.96 9.51,6.96 8.87,6.96 8.87,6.61 | R10.2 7.77,3.56 7.77,5.51 8.87,6.61
  Bottom 0.254: v19.52,5.96 22.52,5.96 22.65,6.08 23.65,6.08 23.77,5.96 26.52,5.96 26.77,6.21 26.77,24.55 26.15,24.55 JP4.3
SWCLK
  Top 0.254: JP1.2 12.08,23.17 U1.45
SWDIO
  Top 0.254: JP1.4 9.27,23.17 9.27,21.71 11.58,21.71 U1.46
VBAT  (via drill 0.6)
  Top 0.305: D1.A 33.7,7.14 v32.65,6.08 | v23.15,5.21 23.15,6.77 U3.3
  Top 0.406: C3.1 20.7,6.85 U3.3 | D1.A 33.7,11.54 | 33.7,11.54 R3.1 | v34.47,13.83 34.43,11.71 34.43,11.54 33.7,11.54
  Bottom 0.305: v32.65,6.08 27.52,6.08 26.65,5.21 v23.15,5.21
  Bottom 0.406: JP6.1 33.99,26.23 34.52,25.09 34.5,20 34.5,14.3 v34.47,13.83
VBUS
  Top 0.254: 41.29,4.44 X3.VBUS
  Top 0.406: 41.29,4.44 40.53,4.44 C6.1 D1.C 36.27,6.75 36.27,4.71 32.77,4.71 S3.2 31.27,3.53 31.27,7.21 27.02,7.21 27.02,6.85 U3.4
VDDCORE
  Top 0.305: U1.43 13.08,20.48 C9.1

### Text on the board
tPlace: OLED | BAT IN | Reset | Feather M0 | Skate Remote | IT | v0.5
bPlace: !reset | 3.3v | GND | SCL | SDA | RST | + | - | D6 | D5 | 3.3V | 3.3v | GND | swdio | swclk | A0 | A1 | (D16)A2 | Feather M0 Remote | GND
200bmp: C:/Users/Isaac/Desktop/skateboard-256.bmp